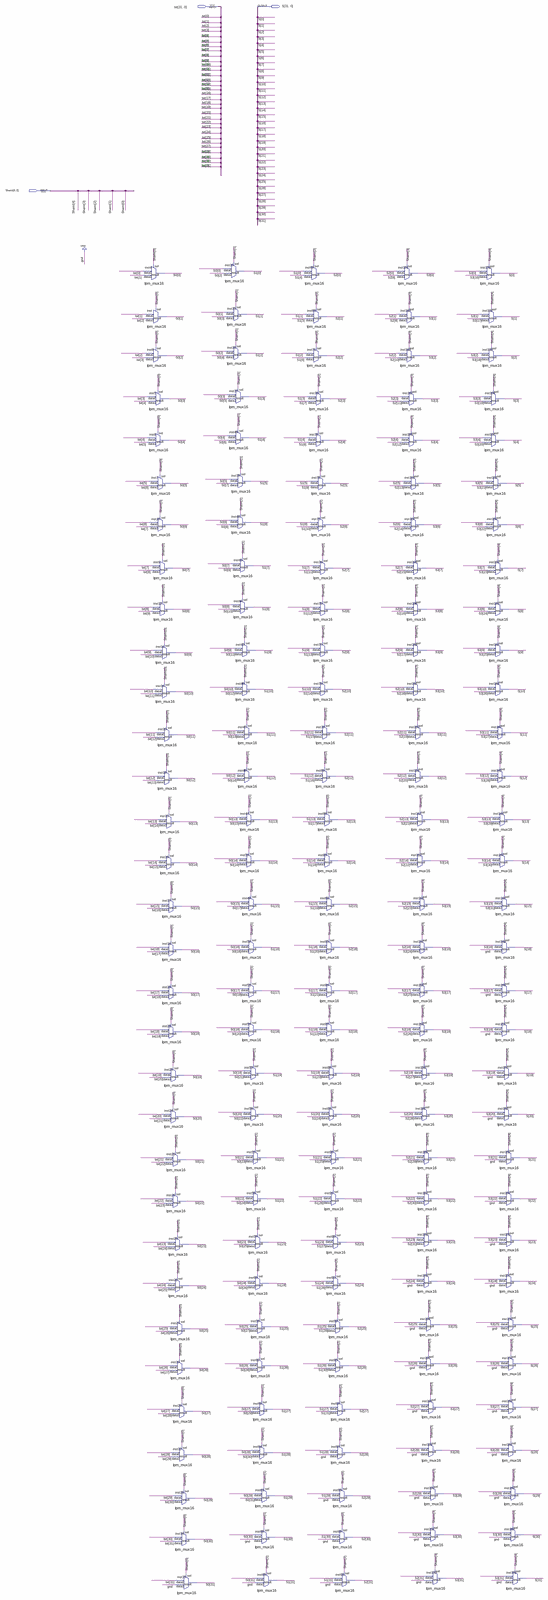
[diagram p0: schematic sheet, whole]
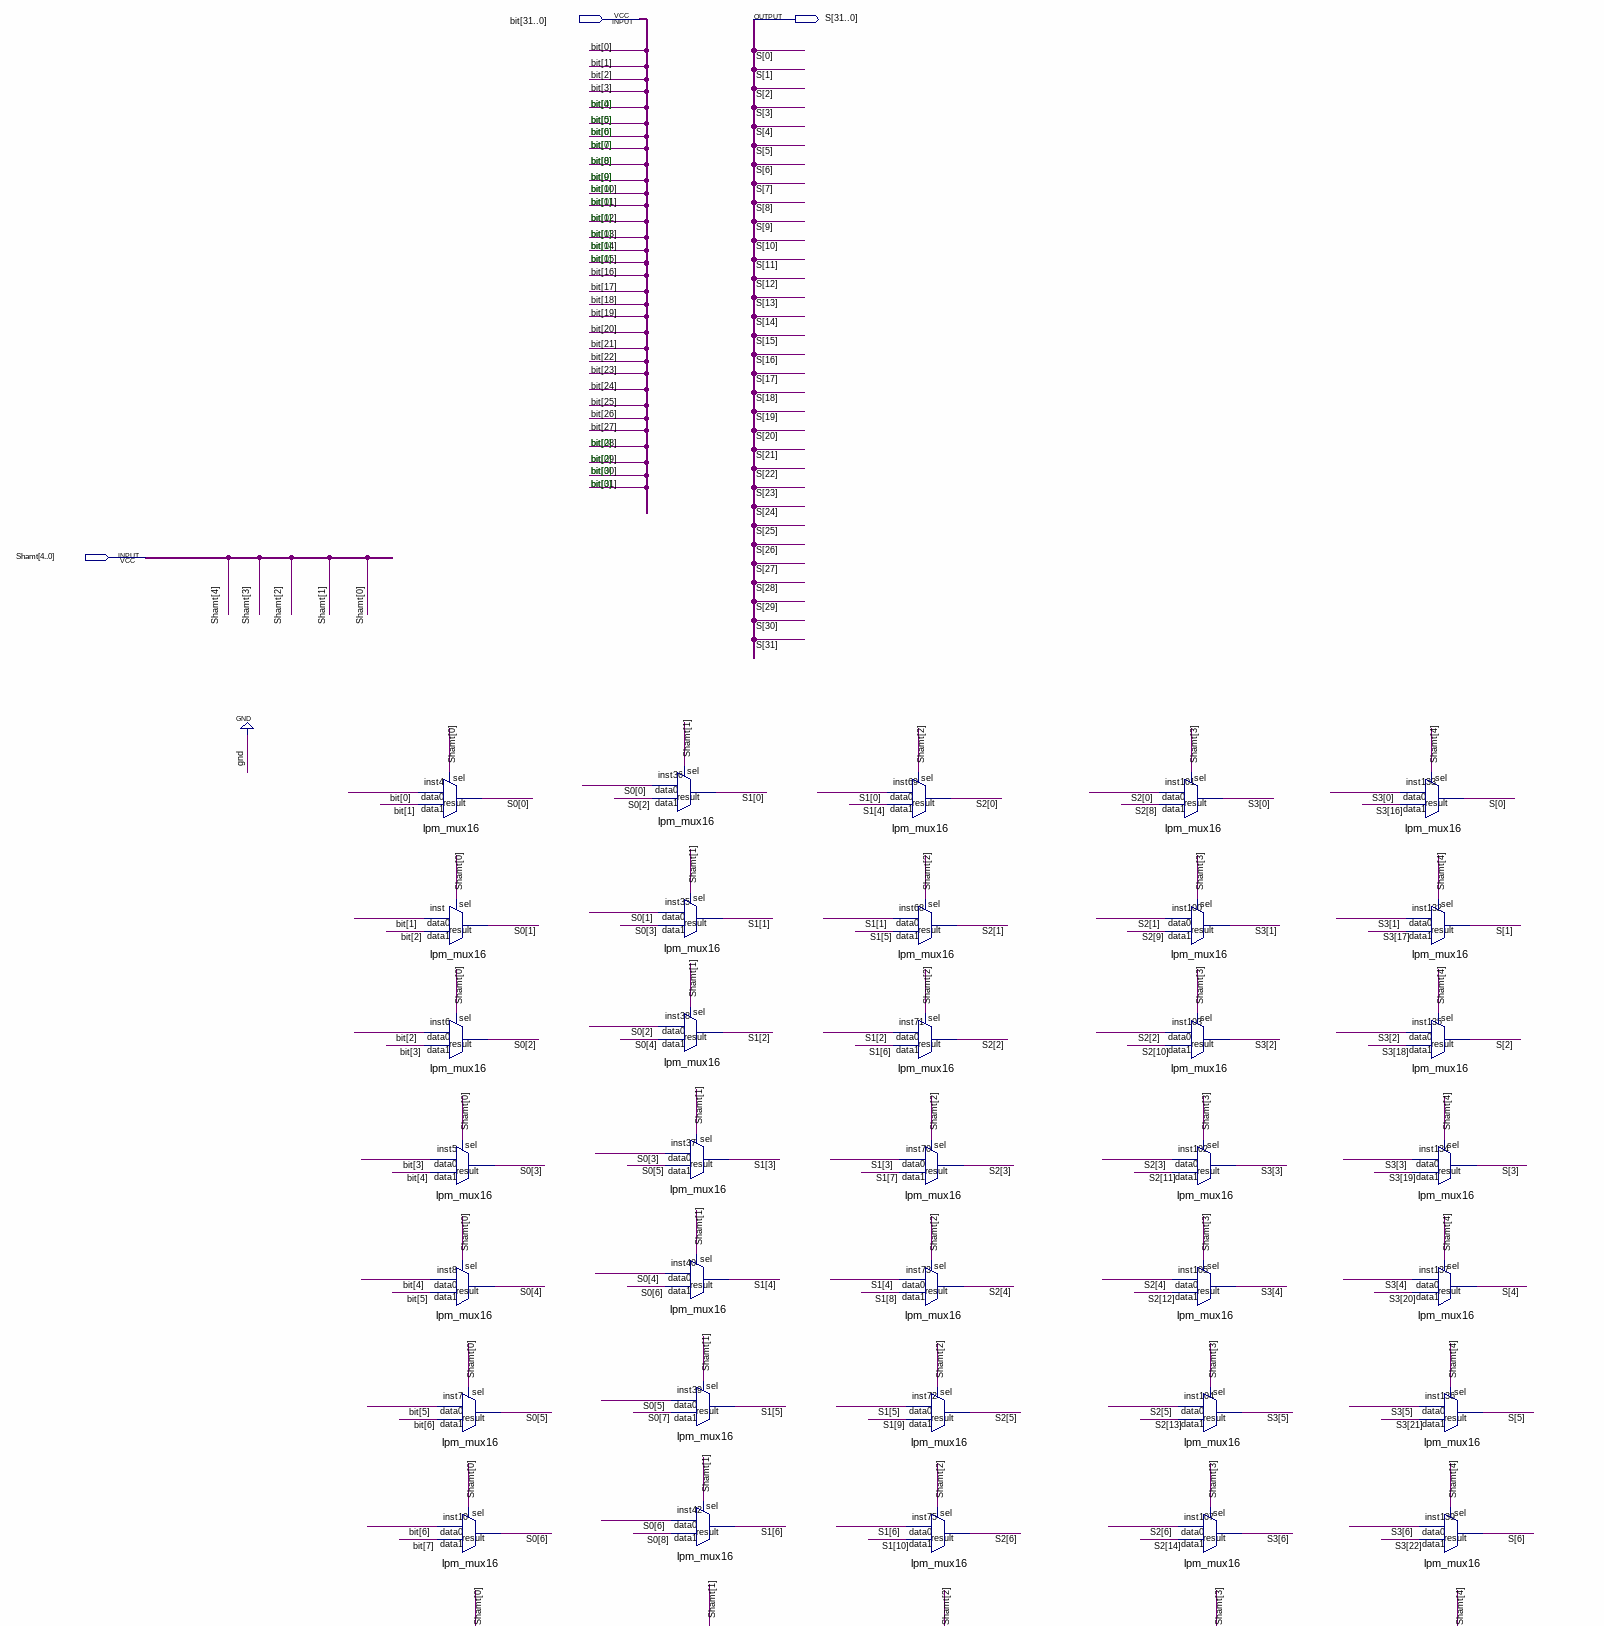
[diagram p1: schematic sheet, upper part]
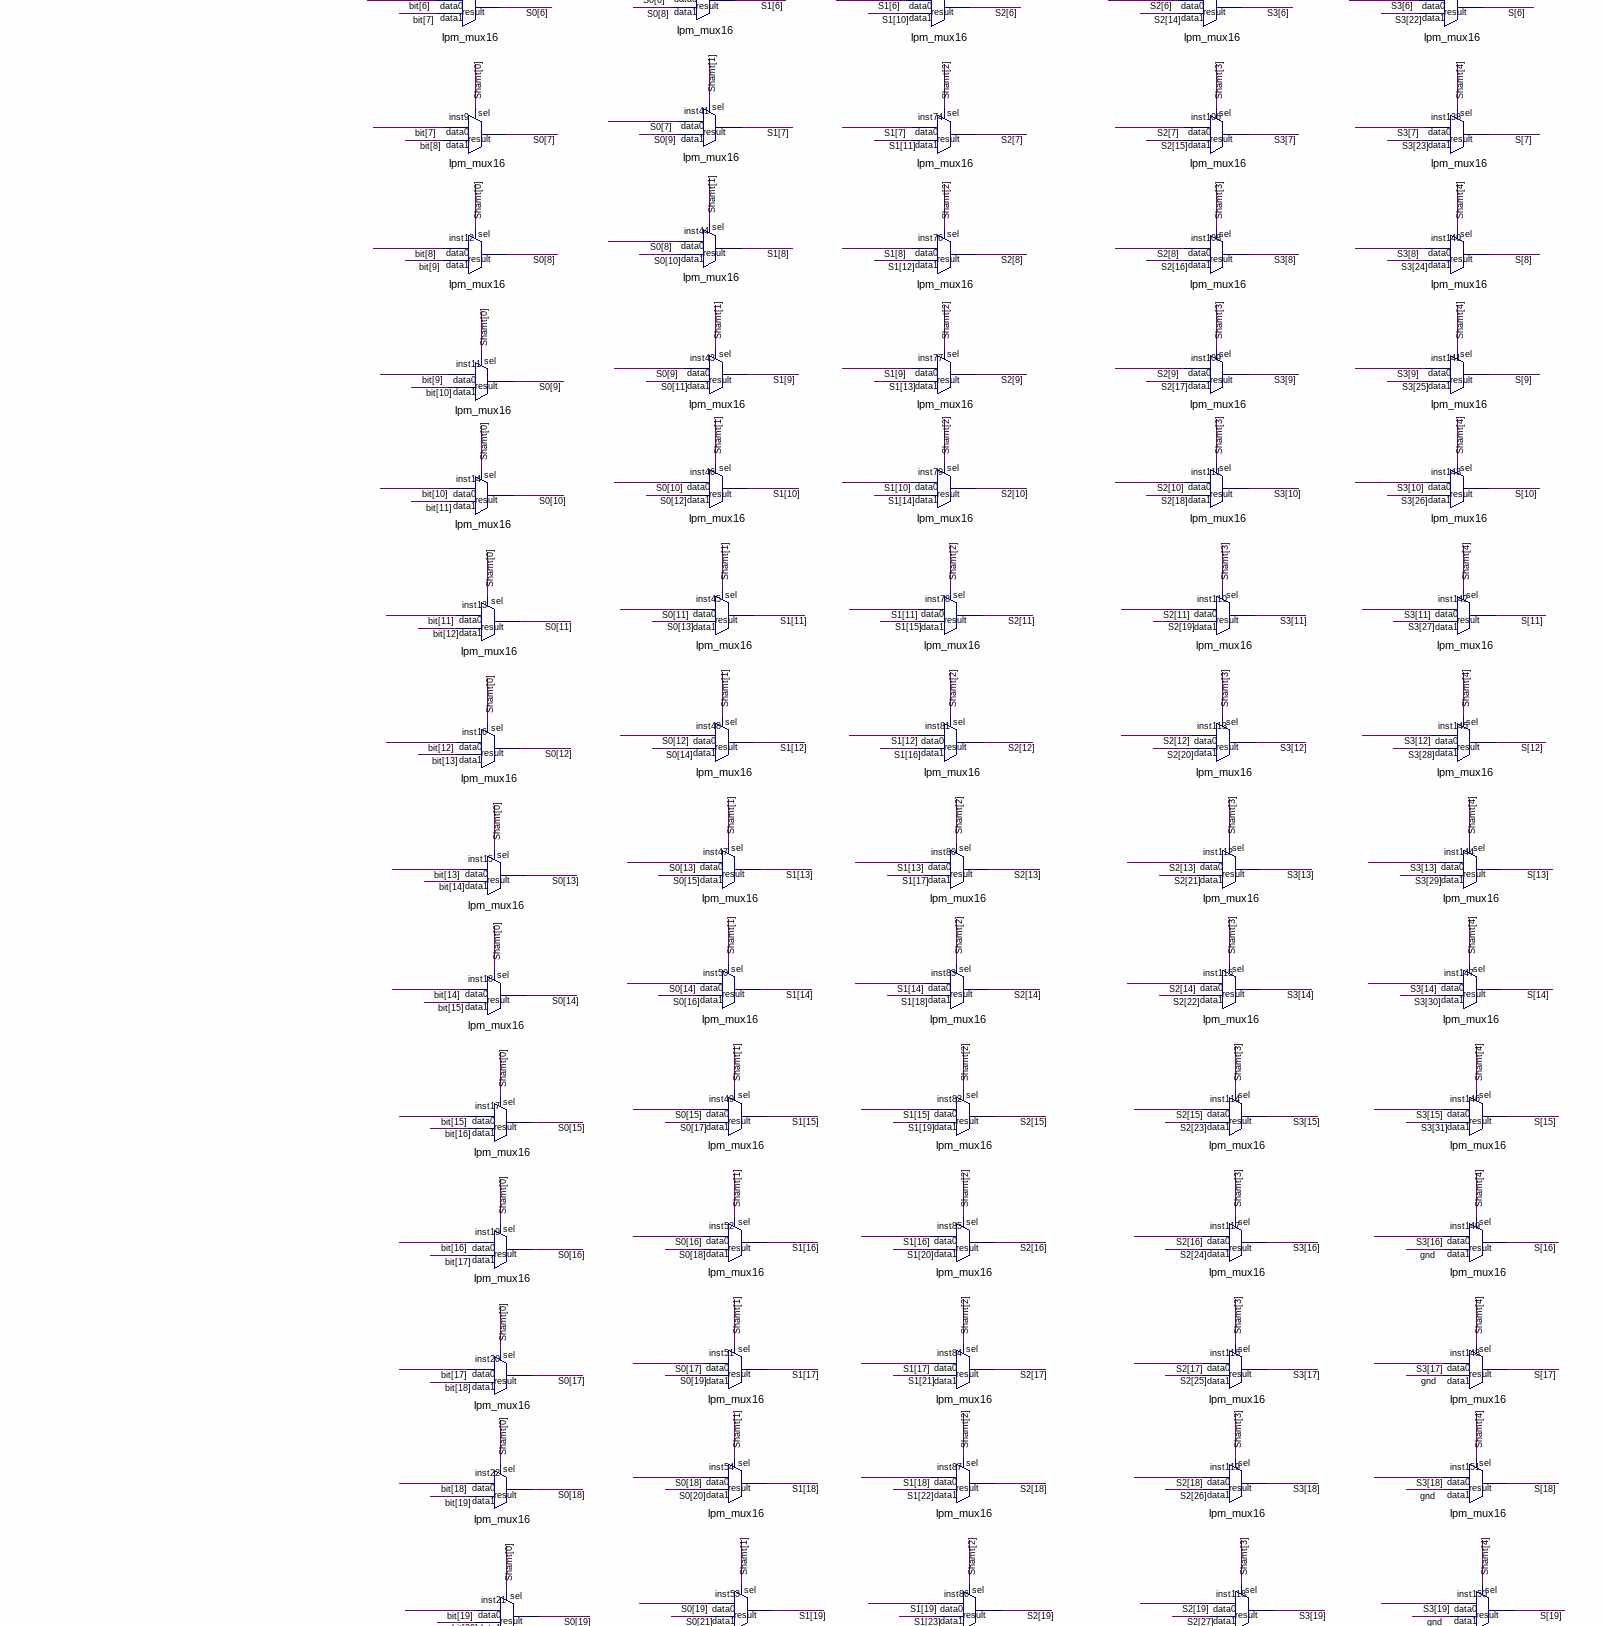
[diagram p2: schematic sheet, middle part]
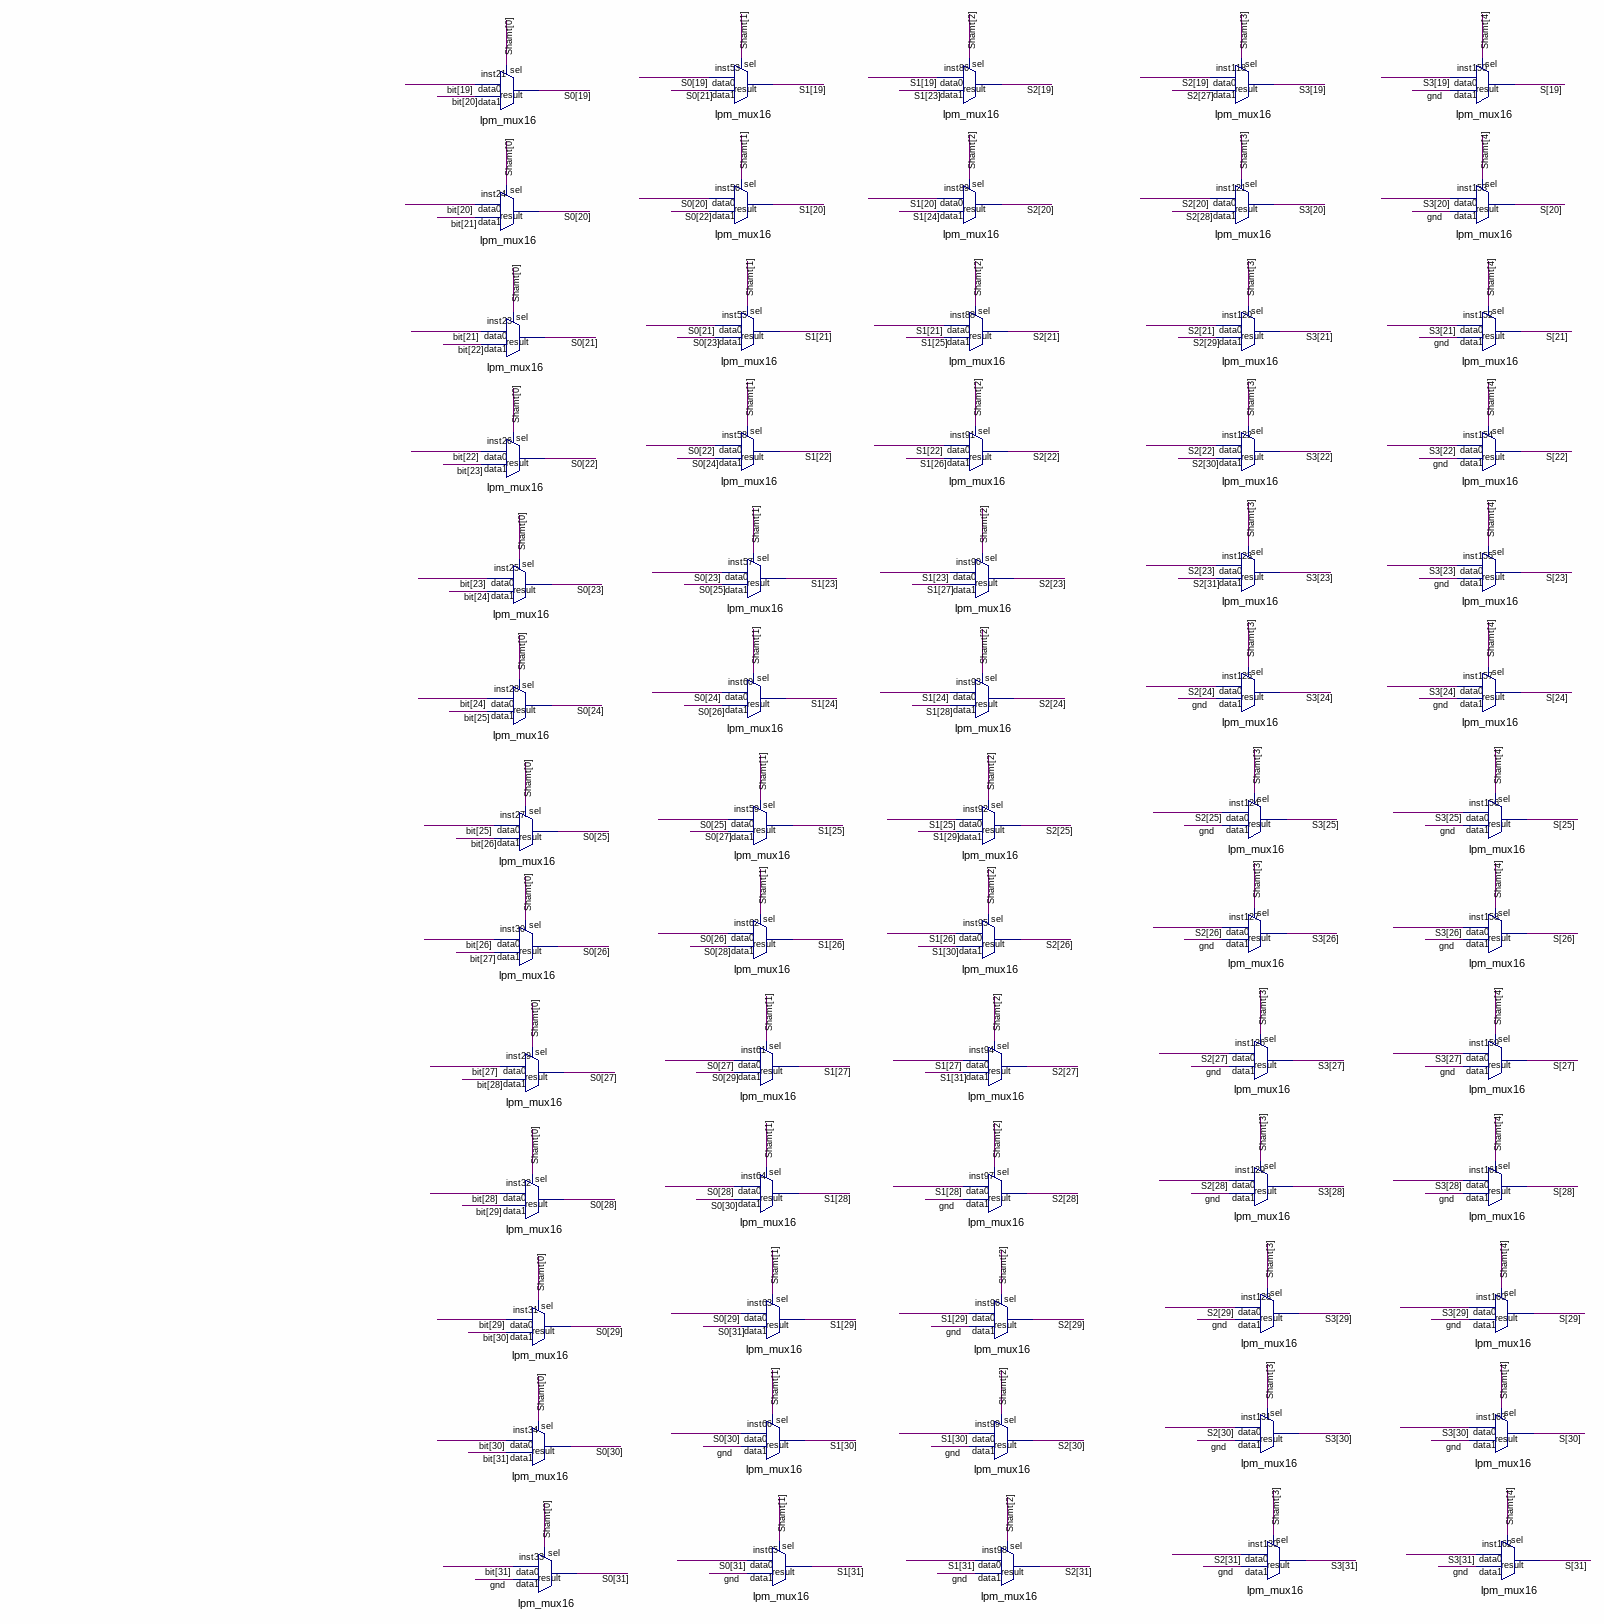
[diagram p3: schematic sheet, lower part]
// Quartus schematic Srl.bdf as structural Verilog: 160 symbols, 3 pins
module Srl (
  input  [31:0] \bit ,
  input  [4:0] Shamt,
  output [31:0] S
);

  wire [31:0] S0, S1, S2, S3;

  lpm_mux16 inst4 (.data1(\bit [1]), .data0(\bit [0]), .sel(Shamt[0]), .result(S0[0]));
  lpm_mux16 inst (.data1(\bit [2]), .data0(\bit [1]), .sel(Shamt[0]), .result(S0[1]));
  lpm_mux16 inst6 (.data1(\bit [3]), .data0(\bit [2]), .sel(Shamt[0]), .result(S0[2]));
  lpm_mux16 inst5 (.data1(\bit [4]), .data0(\bit [3]), .sel(Shamt[0]), .result(S0[3]));
  lpm_mux16 inst8 (.data1(\bit [5]), .data0(\bit [4]), .sel(Shamt[0]), .result(S0[4]));
  lpm_mux16 inst7 (.data1(\bit [6]), .data0(\bit [5]), .sel(Shamt[0]), .result(S0[5]));
  lpm_mux16 inst10 (.data1(\bit [7]), .data0(\bit [6]), .sel(Shamt[0]), .result(S0[6]));
  lpm_mux16 inst9 (.data1(\bit [8]), .data0(\bit [7]), .sel(Shamt[0]), .result(S0[7]));
  lpm_mux16 inst12 (.data1(\bit [9]), .data0(\bit [8]), .sel(Shamt[0]), .result(S0[8]));
  lpm_mux16 inst11 (.data1(\bit [10]), .data0(\bit [9]), .sel(Shamt[0]), .result(S0[9]));
  lpm_mux16 inst14 (.data1(\bit [11]), .data0(\bit [10]), .sel(Shamt[0]), .result(S0[10]));
  lpm_mux16 inst13 (.data1(\bit [12]), .data0(\bit [11]), .sel(Shamt[0]), .result(S0[11]));
  lpm_mux16 inst16 (.data1(\bit [13]), .data0(\bit [12]), .sel(Shamt[0]), .result(S0[12]));
  lpm_mux16 inst15 (.data1(\bit [14]), .data0(\bit [13]), .sel(Shamt[0]), .result(S0[13]));
  lpm_mux16 inst18 (.data1(\bit [15]), .data0(\bit [14]), .sel(Shamt[0]), .result(S0[14]));
  lpm_mux16 inst17 (.data1(\bit [16]), .data0(\bit [15]), .sel(Shamt[0]), .result(S0[15]));
  lpm_mux16 inst19 (.data1(\bit [17]), .data0(\bit [16]), .sel(Shamt[0]), .result(S0[16]));
  lpm_mux16 inst20 (.data1(\bit [18]), .data0(\bit [17]), .sel(Shamt[0]), .result(S0[17]));
  lpm_mux16 inst22 (.data1(\bit [19]), .data0(\bit [18]), .sel(Shamt[0]), .result(S0[18]));
  lpm_mux16 inst21 (.data1(\bit [20]), .data0(\bit [19]), .sel(Shamt[0]), .result(S0[19]));
  lpm_mux16 inst24 (.data1(\bit [21]), .data0(\bit [20]), .sel(Shamt[0]), .result(S0[20]));
  lpm_mux16 inst23 (.data1(\bit [22]), .data0(\bit [21]), .sel(Shamt[0]), .result(S0[21]));
  lpm_mux16 inst26 (.data1(\bit [23]), .data0(\bit [22]), .sel(Shamt[0]), .result(S0[22]));
  lpm_mux16 inst25 (.data1(\bit [24]), .data0(\bit [23]), .sel(Shamt[0]), .result(S0[23]));
  lpm_mux16 inst28 (.data1(\bit [25]), .data0(\bit [24]), .sel(Shamt[0]), .result(S0[24]));
  lpm_mux16 inst27 (.data1(\bit [26]), .data0(\bit [25]), .sel(Shamt[0]), .result(S0[25]));
  lpm_mux16 inst30 (.data1(\bit [27]), .data0(\bit [26]), .sel(Shamt[0]), .result(S0[26]));
  lpm_mux16 inst29 (.data1(\bit [28]), .data0(\bit [27]), .sel(Shamt[0]), .result(S0[27]));
  lpm_mux16 inst32 (.data1(\bit [29]), .data0(\bit [28]), .sel(Shamt[0]), .result(S0[28]));
  lpm_mux16 inst31 (.data1(\bit [30]), .data0(\bit [29]), .sel(Shamt[0]), .result(S0[29]));
  lpm_mux16 inst34 (.data1(\bit [31]), .data0(\bit [30]), .sel(Shamt[0]), .result(S0[30]));
  lpm_mux16 inst33 (.data1(1'b0), .data0(\bit [31]), .sel(Shamt[0]), .result(S0[31]));
  lpm_mux16 inst36 (.data1(S0[2]), .data0(S0[0]), .sel(Shamt[1]), .result(S1[0]));
  lpm_mux16 inst35 (.data1(S0[3]), .data0(S0[1]), .sel(Shamt[1]), .result(S1[1]));
  lpm_mux16 inst38 (.data1(S0[4]), .data0(S0[2]), .sel(Shamt[1]), .result(S1[2]));
  lpm_mux16 inst37 (.data1(S0[5]), .data0(S0[3]), .sel(Shamt[1]), .result(S1[3]));
  lpm_mux16 inst40 (.data1(S0[6]), .data0(S0[4]), .sel(Shamt[1]), .result(S1[4]));
  lpm_mux16 inst39 (.data1(S0[7]), .data0(S0[5]), .sel(Shamt[1]), .result(S1[5]));
  lpm_mux16 inst42 (.data1(S0[8]), .data0(S0[6]), .sel(Shamt[1]), .result(S1[6]));
  lpm_mux16 inst41 (.data1(S0[9]), .data0(S0[7]), .sel(Shamt[1]), .result(S1[7]));
  lpm_mux16 inst44 (.data1(S0[10]), .data0(S0[8]), .sel(Shamt[1]), .result(S1[8]));
  lpm_mux16 inst43 (.data1(S0[11]), .data0(S0[9]), .sel(Shamt[1]), .result(S1[9]));
  lpm_mux16 inst46 (.data1(S0[12]), .data0(S0[10]), .sel(Shamt[1]), .result(S1[10]));
  lpm_mux16 inst45 (.data1(S0[13]), .data0(S0[11]), .sel(Shamt[1]), .result(S1[11]));
  lpm_mux16 inst48 (.data1(S0[14]), .data0(S0[12]), .sel(Shamt[1]), .result(S1[12]));
  lpm_mux16 inst47 (.data1(S0[15]), .data0(S0[13]), .sel(Shamt[1]), .result(S1[13]));
  lpm_mux16 inst50 (.data1(S0[16]), .data0(S0[14]), .sel(Shamt[1]), .result(S1[14]));
  lpm_mux16 inst49 (.data1(S0[17]), .data0(S0[15]), .sel(Shamt[1]), .result(S1[15]));
  lpm_mux16 inst52 (.data1(S0[18]), .data0(S0[16]), .sel(Shamt[1]), .result(S1[16]));
  lpm_mux16 inst51 (.data1(S0[19]), .data0(S0[17]), .sel(Shamt[1]), .result(S1[17]));
  lpm_mux16 inst54 (.data1(S0[20]), .data0(S0[18]), .sel(Shamt[1]), .result(S1[18]));
  lpm_mux16 inst53 (.data1(S0[21]), .data0(S0[19]), .sel(Shamt[1]), .result(S1[19]));
  lpm_mux16 inst56 (.data1(S0[22]), .data0(S0[20]), .sel(Shamt[1]), .result(S1[20]));
  lpm_mux16 inst55 (.data1(S0[23]), .data0(S0[21]), .sel(Shamt[1]), .result(S1[21]));
  lpm_mux16 inst58 (.data1(S0[24]), .data0(S0[22]), .sel(Shamt[1]), .result(S1[22]));
  lpm_mux16 inst57 (.data1(S0[25]), .data0(S0[23]), .sel(Shamt[1]), .result(S1[23]));
  lpm_mux16 inst60 (.data1(S0[26]), .data0(S0[24]), .sel(Shamt[1]), .result(S1[24]));
  lpm_mux16 inst59 (.data1(S0[27]), .data0(S0[25]), .sel(Shamt[1]), .result(S1[25]));
  lpm_mux16 inst62 (.data1(S0[28]), .data0(S0[26]), .sel(Shamt[1]), .result(S1[26]));
  lpm_mux16 inst61 (.data1(S0[29]), .data0(S0[27]), .sel(Shamt[1]), .result(S1[27]));
  lpm_mux16 inst64 (.data1(S0[30]), .data0(S0[28]), .sel(Shamt[1]), .result(S1[28]));
  lpm_mux16 inst63 (.data1(S0[31]), .data0(S0[29]), .sel(Shamt[1]), .result(S1[29]));
  lpm_mux16 inst66 (.data1(1'b0), .data0(S0[30]), .sel(Shamt[1]), .result(S1[30]));
  lpm_mux16 inst65 (.data1(1'b0), .data0(S0[31]), .sel(Shamt[1]), .result(S1[31]));
  lpm_mux16 inst69 (.data1(S1[4]), .data0(S1[0]), .sel(Shamt[2]), .result(S2[0]));
  lpm_mux16 inst68 (.data1(S1[5]), .data0(S1[1]), .sel(Shamt[2]), .result(S2[1]));
  lpm_mux16 inst71 (.data1(S1[6]), .data0(S1[2]), .sel(Shamt[2]), .result(S2[2]));
  lpm_mux16 inst70 (.data1(S1[7]), .data0(S1[3]), .sel(Shamt[2]), .result(S2[3]));
  lpm_mux16 inst73 (.data1(S1[8]), .data0(S1[4]), .sel(Shamt[2]), .result(S2[4]));
  lpm_mux16 inst72 (.data1(S1[9]), .data0(S1[5]), .sel(Shamt[2]), .result(S2[5]));
  lpm_mux16 inst75 (.data1(S1[10]), .data0(S1[6]), .sel(Shamt[2]), .result(S2[6]));
  lpm_mux16 inst74 (.data1(S1[11]), .data0(S1[7]), .sel(Shamt[2]), .result(S2[7]));
  lpm_mux16 inst76 (.data1(S1[12]), .data0(S1[8]), .sel(Shamt[2]), .result(S2[8]));
  lpm_mux16 inst77 (.data1(S1[13]), .data0(S1[9]), .sel(Shamt[2]), .result(S2[9]));
  lpm_mux16 inst79 (.data1(S1[14]), .data0(S1[10]), .sel(Shamt[2]), .result(S2[10]));
  lpm_mux16 inst78 (.data1(S1[15]), .data0(S1[11]), .sel(Shamt[2]), .result(S2[11]));
  lpm_mux16 inst81 (.data1(S1[16]), .data0(S1[12]), .sel(Shamt[2]), .result(S2[12]));
  lpm_mux16 inst80 (.data1(S1[17]), .data0(S1[13]), .sel(Shamt[2]), .result(S2[13]));
  lpm_mux16 inst83 (.data1(S1[18]), .data0(S1[14]), .sel(Shamt[2]), .result(S2[14]));
  lpm_mux16 inst82 (.data1(S1[19]), .data0(S1[15]), .sel(Shamt[2]), .result(S2[15]));
  lpm_mux16 inst85 (.data1(S1[20]), .data0(S1[16]), .sel(Shamt[2]), .result(S2[16]));
  lpm_mux16 inst84 (.data1(S1[21]), .data0(S1[17]), .sel(Shamt[2]), .result(S2[17]));
  lpm_mux16 inst87 (.data1(S1[22]), .data0(S1[18]), .sel(Shamt[2]), .result(S2[18]));
  lpm_mux16 inst86 (.data1(S1[23]), .data0(S1[19]), .sel(Shamt[2]), .result(S2[19]));
  lpm_mux16 inst89 (.data1(S1[24]), .data0(S1[20]), .sel(Shamt[2]), .result(S2[20]));
  lpm_mux16 inst88 (.data1(S1[25]), .data0(S1[21]), .sel(Shamt[2]), .result(S2[21]));
  lpm_mux16 inst91 (.data1(S1[26]), .data0(S1[22]), .sel(Shamt[2]), .result(S2[22]));
  lpm_mux16 inst90 (.data1(S1[27]), .data0(S1[23]), .sel(Shamt[2]), .result(S2[23]));
  lpm_mux16 inst93 (.data1(S1[28]), .data0(S1[24]), .sel(Shamt[2]), .result(S2[24]));
  lpm_mux16 inst92 (.data1(S1[29]), .data0(S1[25]), .sel(Shamt[2]), .result(S2[25]));
  lpm_mux16 inst95 (.data1(S1[30]), .data0(S1[26]), .sel(Shamt[2]), .result(S2[26]));
  lpm_mux16 inst94 (.data1(S1[31]), .data0(S1[27]), .sel(Shamt[2]), .result(S2[27]));
  lpm_mux16 inst97 (.data1(1'b0), .data0(S1[28]), .sel(Shamt[2]), .result(S2[28]));
  lpm_mux16 inst96 (.data1(1'b0), .data0(S1[29]), .sel(Shamt[2]), .result(S2[29]));
  lpm_mux16 inst99 (.data1(1'b0), .data0(S1[30]), .sel(Shamt[2]), .result(S2[30]));
  lpm_mux16 inst98 (.data1(1'b0), .data0(S1[31]), .sel(Shamt[2]), .result(S2[31]));
  lpm_mux16 inst101 (.data1(S2[8]), .data0(S2[0]), .sel(Shamt[3]), .result(S3[0]));
  lpm_mux16 inst100 (.data1(S2[9]), .data0(S2[1]), .sel(Shamt[3]), .result(S3[1]));
  lpm_mux16 inst103 (.data1(S2[10]), .data0(S2[2]), .sel(Shamt[3]), .result(S3[2]));
  lpm_mux16 inst102 (.data1(S2[11]), .data0(S2[3]), .sel(Shamt[3]), .result(S3[3]));
  lpm_mux16 inst105 (.data1(S2[12]), .data0(S2[4]), .sel(Shamt[3]), .result(S3[4]));
  lpm_mux16 inst104 (.data1(S2[13]), .data0(S2[5]), .sel(Shamt[3]), .result(S3[5]));
  lpm_mux16 inst107 (.data1(S2[14]), .data0(S2[6]), .sel(Shamt[3]), .result(S3[6]));
  lpm_mux16 inst106 (.data1(S2[15]), .data0(S2[7]), .sel(Shamt[3]), .result(S3[7]));
  lpm_mux16 inst108 (.data1(S2[16]), .data0(S2[8]), .sel(Shamt[3]), .result(S3[8]));
  lpm_mux16 inst109 (.data1(S2[17]), .data0(S2[9]), .sel(Shamt[3]), .result(S3[9]));
  lpm_mux16 inst111 (.data1(S2[18]), .data0(S2[10]), .sel(Shamt[3]), .result(S3[10]));
  lpm_mux16 inst110 (.data1(S2[19]), .data0(S2[11]), .sel(Shamt[3]), .result(S3[11]));
  lpm_mux16 inst113 (.data1(S2[20]), .data0(S2[12]), .sel(Shamt[3]), .result(S3[12]));
  lpm_mux16 inst112 (.data1(S2[21]), .data0(S2[13]), .sel(Shamt[3]), .result(S3[13]));
  lpm_mux16 inst115 (.data1(S2[22]), .data0(S2[14]), .sel(Shamt[3]), .result(S3[14]));
  lpm_mux16 inst114 (.data1(S2[23]), .data0(S2[15]), .sel(Shamt[3]), .result(S3[15]));
  lpm_mux16 inst117 (.data1(S2[24]), .data0(S2[16]), .sel(Shamt[3]), .result(S3[16]));
  lpm_mux16 inst116 (.data1(S2[25]), .data0(S2[17]), .sel(Shamt[3]), .result(S3[17]));
  lpm_mux16 inst119 (.data1(S2[26]), .data0(S2[18]), .sel(Shamt[3]), .result(S3[18]));
  lpm_mux16 inst118 (.data1(S2[27]), .data0(S2[19]), .sel(Shamt[3]), .result(S3[19]));
  lpm_mux16 inst121 (.data1(S2[28]), .data0(S2[20]), .sel(Shamt[3]), .result(S3[20]));
  lpm_mux16 inst120 (.data1(S2[29]), .data0(S2[21]), .sel(Shamt[3]), .result(S3[21]));
  lpm_mux16 inst122 (.data1(S2[30]), .data0(S2[22]), .sel(Shamt[3]), .result(S3[22]));
  lpm_mux16 inst123 (.data1(S2[31]), .data0(S2[23]), .sel(Shamt[3]), .result(S3[23]));
  lpm_mux16 inst125 (.data1(1'b0), .data0(S2[24]), .sel(Shamt[3]), .result(S3[24]));
  lpm_mux16 inst124 (.data1(1'b0), .data0(S2[25]), .sel(Shamt[3]), .result(S3[25]));
  lpm_mux16 inst127 (.data1(1'b0), .data0(S2[26]), .sel(Shamt[3]), .result(S3[26]));
  lpm_mux16 inst126 (.data1(1'b0), .data0(S2[27]), .sel(Shamt[3]), .result(S3[27]));
  lpm_mux16 inst129 (.data1(1'b0), .data0(S2[28]), .sel(Shamt[3]), .result(S3[28]));
  lpm_mux16 inst128 (.data1(1'b0), .data0(S2[29]), .sel(Shamt[3]), .result(S3[29]));
  lpm_mux16 inst131 (.data1(1'b0), .data0(S2[30]), .sel(Shamt[3]), .result(S3[30]));
  lpm_mux16 inst130 (.data1(1'b0), .data0(S2[31]), .sel(Shamt[3]), .result(S3[31]));
  lpm_mux16 inst133 (.data1(S3[16]), .data0(S3[0]), .sel(Shamt[4]), .result(S[0]));
  lpm_mux16 inst132 (.data1(S3[17]), .data0(S3[1]), .sel(Shamt[4]), .result(S[1]));
  lpm_mux16 inst135 (.data1(S3[18]), .data0(S3[2]), .sel(Shamt[4]), .result(S[2]));
  lpm_mux16 inst134 (.data1(S3[19]), .data0(S3[3]), .sel(Shamt[4]), .result(S[3]));
  lpm_mux16 inst137 (.data1(S3[20]), .data0(S3[4]), .sel(Shamt[4]), .result(S[4]));
  lpm_mux16 inst136 (.data1(S3[21]), .data0(S3[5]), .sel(Shamt[4]), .result(S[5]));
  lpm_mux16 inst139 (.data1(S3[22]), .data0(S3[6]), .sel(Shamt[4]), .result(S[6]));
  lpm_mux16 inst138 (.data1(S3[23]), .data0(S3[7]), .sel(Shamt[4]), .result(S[7]));
  lpm_mux16 inst140 (.data1(S3[24]), .data0(S3[8]), .sel(Shamt[4]), .result(S[8]));
  lpm_mux16 inst141 (.data1(S3[25]), .data0(S3[9]), .sel(Shamt[4]), .result(S[9]));
  lpm_mux16 inst143 (.data1(S3[26]), .data0(S3[10]), .sel(Shamt[4]), .result(S[10]));
  lpm_mux16 inst142 (.data1(S3[27]), .data0(S3[11]), .sel(Shamt[4]), .result(S[11]));
  lpm_mux16 inst145 (.data1(S3[28]), .data0(S3[12]), .sel(Shamt[4]), .result(S[12]));
  lpm_mux16 inst144 (.data1(S3[29]), .data0(S3[13]), .sel(Shamt[4]), .result(S[13]));
  lpm_mux16 inst147 (.data1(S3[30]), .data0(S3[14]), .sel(Shamt[4]), .result(S[14]));
  lpm_mux16 inst146 (.data1(S3[31]), .data0(S3[15]), .sel(Shamt[4]), .result(S[15]));
  lpm_mux16 inst149 (.data1(1'b0), .data0(S3[16]), .sel(Shamt[4]), .result(S[16]));
  lpm_mux16 inst148 (.data1(1'b0), .data0(S3[17]), .sel(Shamt[4]), .result(S[17]));
  lpm_mux16 inst151 (.data1(1'b0), .data0(S3[18]), .sel(Shamt[4]), .result(S[18]));
  lpm_mux16 inst150 (.data1(1'b0), .data0(S3[19]), .sel(Shamt[4]), .result(S[19]));
  lpm_mux16 inst153 (.data1(1'b0), .data0(S3[20]), .sel(Shamt[4]), .result(S[20]));
  lpm_mux16 inst152 (.data1(1'b0), .data0(S3[21]), .sel(Shamt[4]), .result(S[21]));
  lpm_mux16 inst154 (.data1(1'b0), .data0(S3[22]), .sel(Shamt[4]), .result(S[22]));
  lpm_mux16 inst155 (.data1(1'b0), .data0(S3[23]), .sel(Shamt[4]), .result(S[23]));
  lpm_mux16 inst157 (.data1(1'b0), .data0(S3[24]), .sel(Shamt[4]), .result(S[24]));
  lpm_mux16 inst156 (.data1(1'b0), .data0(S3[25]), .sel(Shamt[4]), .result(S[25]));
  lpm_mux16 inst158 (.data1(1'b0), .data0(S3[26]), .sel(Shamt[4]), .result(S[26]));
  lpm_mux16 inst159 (.data1(1'b0), .data0(S3[27]), .sel(Shamt[4]), .result(S[27]));
  lpm_mux16 inst161 (.data1(1'b0), .data0(S3[28]), .sel(Shamt[4]), .result(S[28]));
  lpm_mux16 inst160 (.data1(1'b0), .data0(S3[29]), .sel(Shamt[4]), .result(S[29]));
  lpm_mux16 inst163 (.data1(1'b0), .data0(S3[30]), .sel(Shamt[4]), .result(S[30]));
  lpm_mux16 inst162 (.data1(1'b0), .data0(S3[31]), .sel(Shamt[4]), .result(S[31]));

  // Notes on the sheet:
  //   bit[0]
  //   bit[0]
  //   bit[0]
  //   bit[0]
  //   bit[0]
  //   bit[0]
  //   bit[0]
  //   bit[0]
  //   bit[0]
  //   bit[0]
  //   bit[0]
  //   bit[0]
  //   bit[0]
  //   bit[0]
  //   bit[0]
  //   bit[0]
endmodule
